# EAGLE design Pneumatic Pulse Controller mk3 (EAGLE 7.6.0)
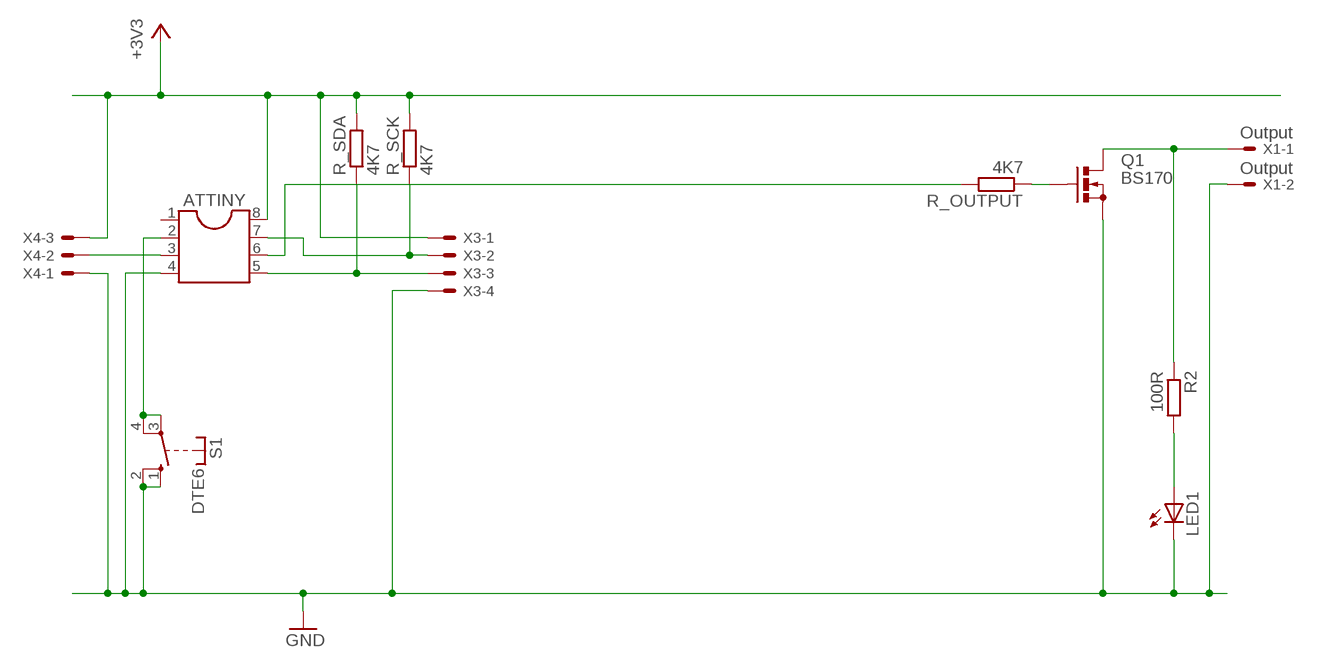
[diagram p0: schematic, sheet 1]

## Parts
ATTINY  DIL8  [DIL08]
LED1  LED3MM  [LED3MM]
Q1  BS170  [SOT54E]
R2  100R  R-EU_0204/7  [0204/7]
R_OUTPUT  4K7  R-EU_M0805  [M0805]
R_SCK  4K7  R-EU_M0805  [M0805]
R_SDA  4K7  R-EU_M0805  [M0805]
S1  DTE6  [DTE6]
X1  Output  KK-156-2  [KK-156-2]
X3  KK-156-4  [KK-156-4]
X4  KK-156-3  [KK-156-3]

## Nets
+3V3: ATTINY.8 R_SCK.2 R_SDA.2 X3.1 X4.3
GND: ATTINY.4 LED1.K(C) Q1.S S1.1(S) S1.2(S) X1.2 X3.4 X4.1
N$1: Q1.G R_OUTPUT.1
N$2: Q1.D R2.1 X1.1
N$5: ATTINY.3 X4.2
N$10: LED1.A R2.2
SCK: ATTINY.7 R_SCK.1 X3.2
SDA: ATTINY.5 R_SDA.1 X3.3
SWITCH: ATTINY.2 S1.3(P) S1.4(P)
VOUT: ATTINY.6 R_OUTPUT.2
Unconnected: ATTINY.1

## Library data of the parts
ATTINY = ic-package:DIL8: Dual In Line / Socket
LED1 = opto:LED: LED OSRAM: - CHIPLED LG R971, LG N971, LY N971, LG Q971, LY Q971, LO R971, LY R971 LH N974, LH R974 LS Q976, LO Q976, LY Q976 LO Q996 - Hyper CHIPLED LW Q18S LB Q993, LB Q99A, LB R99A - SideLED LS A670, LO A670, LY A670, LG A670, LP A670 LB A673, LV A673, LT A673, LW A673 LH A674 LY A675 LS A676, LA A676, LO A676, LY A676, LW A676 LS A679, LY A679, LG A679 - Hyper Micro SIDELED® LS Y876, LA Y876, LO Y876, LY Y876 LT Y87S - SmartLED LW L88C, LW L88S LB L89C, LB L89S, LG L890 LS L89K, LO L89K, LY L89K LS L896, LA L896, LO L896, LY L896 - TOPLED LS T670, LO T670, LY T670, LG T670, LP T670 LSG T670, LSP T670, LSY T670, LOP T670, LYG T670 LG T671, LOG T671, LSG T671 LB T673, LV T673, LT T673, LW T673 LH T674 LS T676, LA T676, LO T676, LY T676, LB T676, LH T676, LSB T676, LW T676 LB T67C, LV T67C, LT T67C, LS T67K, LO T67K, LY T67K, LW E67C LS E67B, LA E67B, LO E67B, LY E67B, LB E67C, LV E67C, LT E67C LW T67C LS T679, LY T679, LG T679 LS T770, LO T770, LY T770, LG T770, LP T770 LB T773, LV T773, LT T773, LW T773 LH T774 LS E675, LA E675, LY E675, LS T675 LS T776, LA T776, LO T776, LY T776, LB T776 LHGB T686 LT T68C, LB T68C - Hyper Mini TOPLED® LB M676 - Mini TOPLED Santana® LG M470 LS M47K, LO M47K, LY M47K Source: http://www.osram.convergy.de LUXEON: - LUMILED® LXK2-PW12-R00, LXK2-PW12-S00, LXK2-PW14-U00, LXK2-PW14-V00 LXK2-PM12-R00, LXK2-PM12-S00, LXK2-PM14-U00 LXK2-PE12-Q00, LXK2-PE12-R00, LXK2-PE12-S00, LXK2-PE14-T00, LXK2-PE14-U00 LXK2-PB12-K00, LXK2-PB12-L00, LXK2-PB12-M00, LXK2-PB14-N00, LXK2-PB14-P00, LXK2-PB14-Q00 LXK2-PR12-L00, LXK2-PR12-M00, LXK2-PR14-Q00, LXK2-PR14-R00 LXK2-PD12-Q00, LXK2-PD12-R00, LXK2-PD12-S00 LXK2-PH12-R00, LXK2-PH12-S00 LXK2-PL12-P00, LXK2-PL12-Q00, LXK2-PL12-R00 Source: www.luxeon.com KINGBRIGHT: KA-3528ASYC Source: www.kingbright.com
Q1 = opto:BS170: N-CHANNEL MOS FET
R2 = opto:R-EU_: RESISTOR, European symbol
R_OUTPUT R_SCK R_SDA = rcl:R-EU_: RESISTOR, European symbol
S1 = opto:DT: ITT SWITCH
X1 = con-molex:KK-156-2: KK 156 HEADER Source: http://www.molex.com/pdm_docs/sd/026604100_sd.pdf; OC_FARNELL: unknown; OC_NEWARK: unknown
X3 = con-molex:KK-156-4: KK 156 HEADER Source: http://www.molex.com/pdm_docs/sd/026604100_sd.pdf; OC_FARNELL: unknown; OC_NEWARK: unknown
X4 = con-molex:KK-156-3: KK 156 HEADER Source: http://www.molex.com/pdm_docs/sd/026604100_sd.pdf; OC_FARNELL: unknown; OC_NEWARK: unknown

## Board
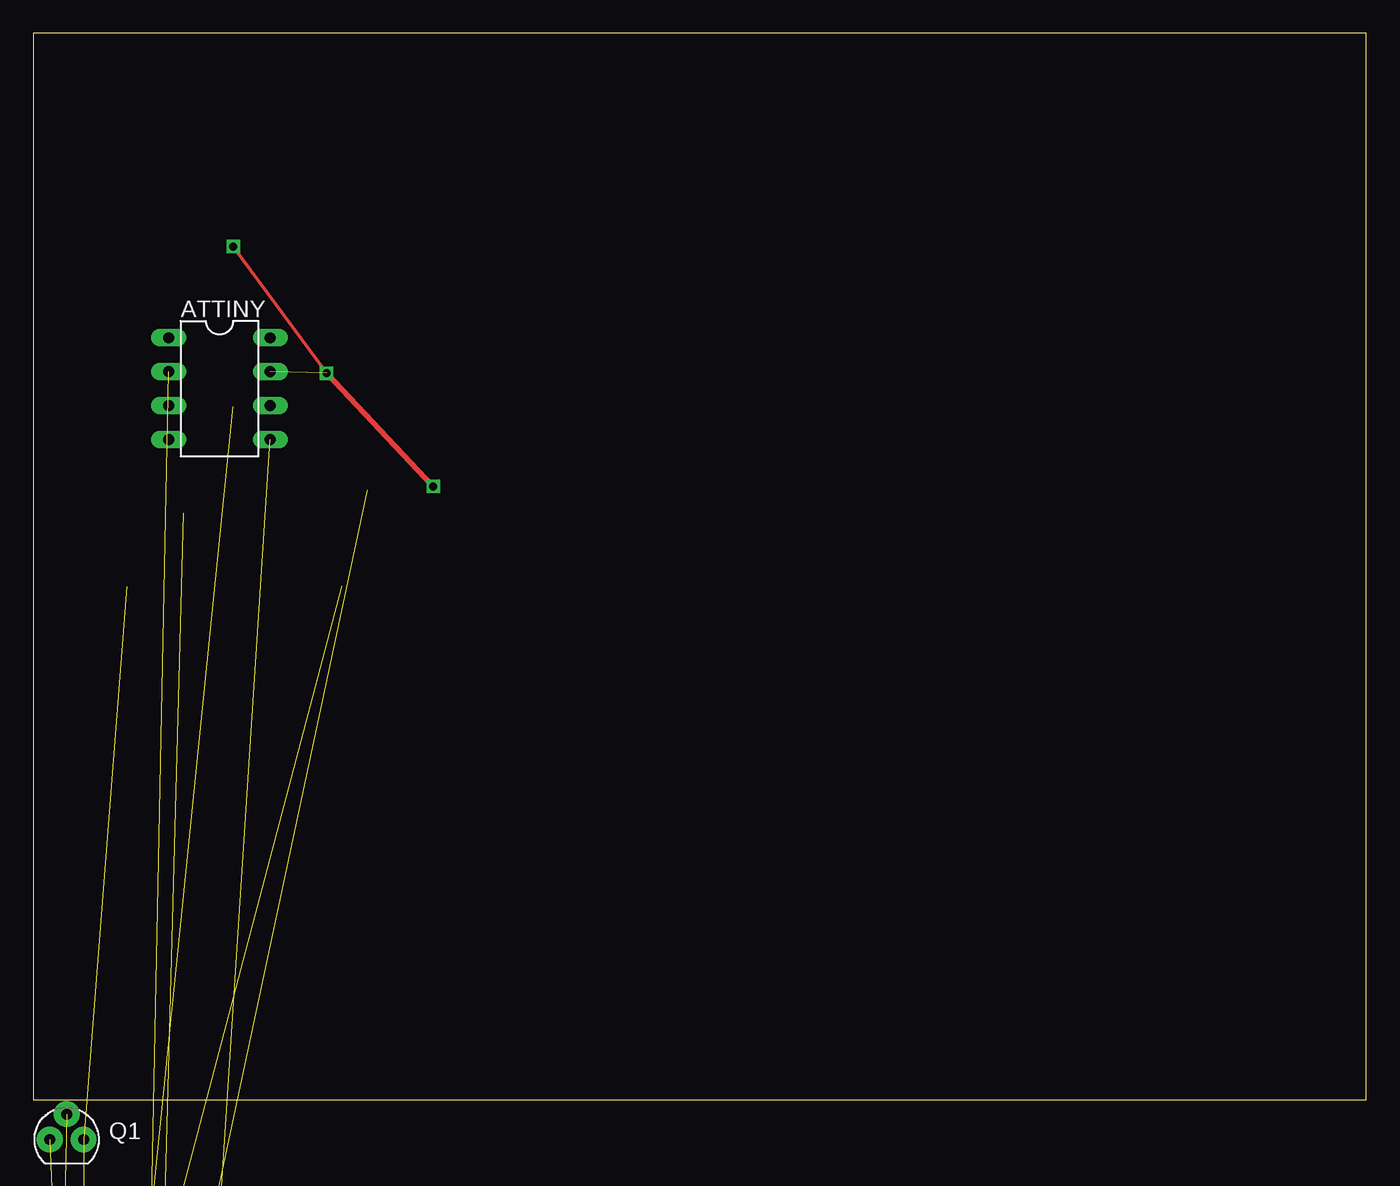
[diagram p1: board, top side]
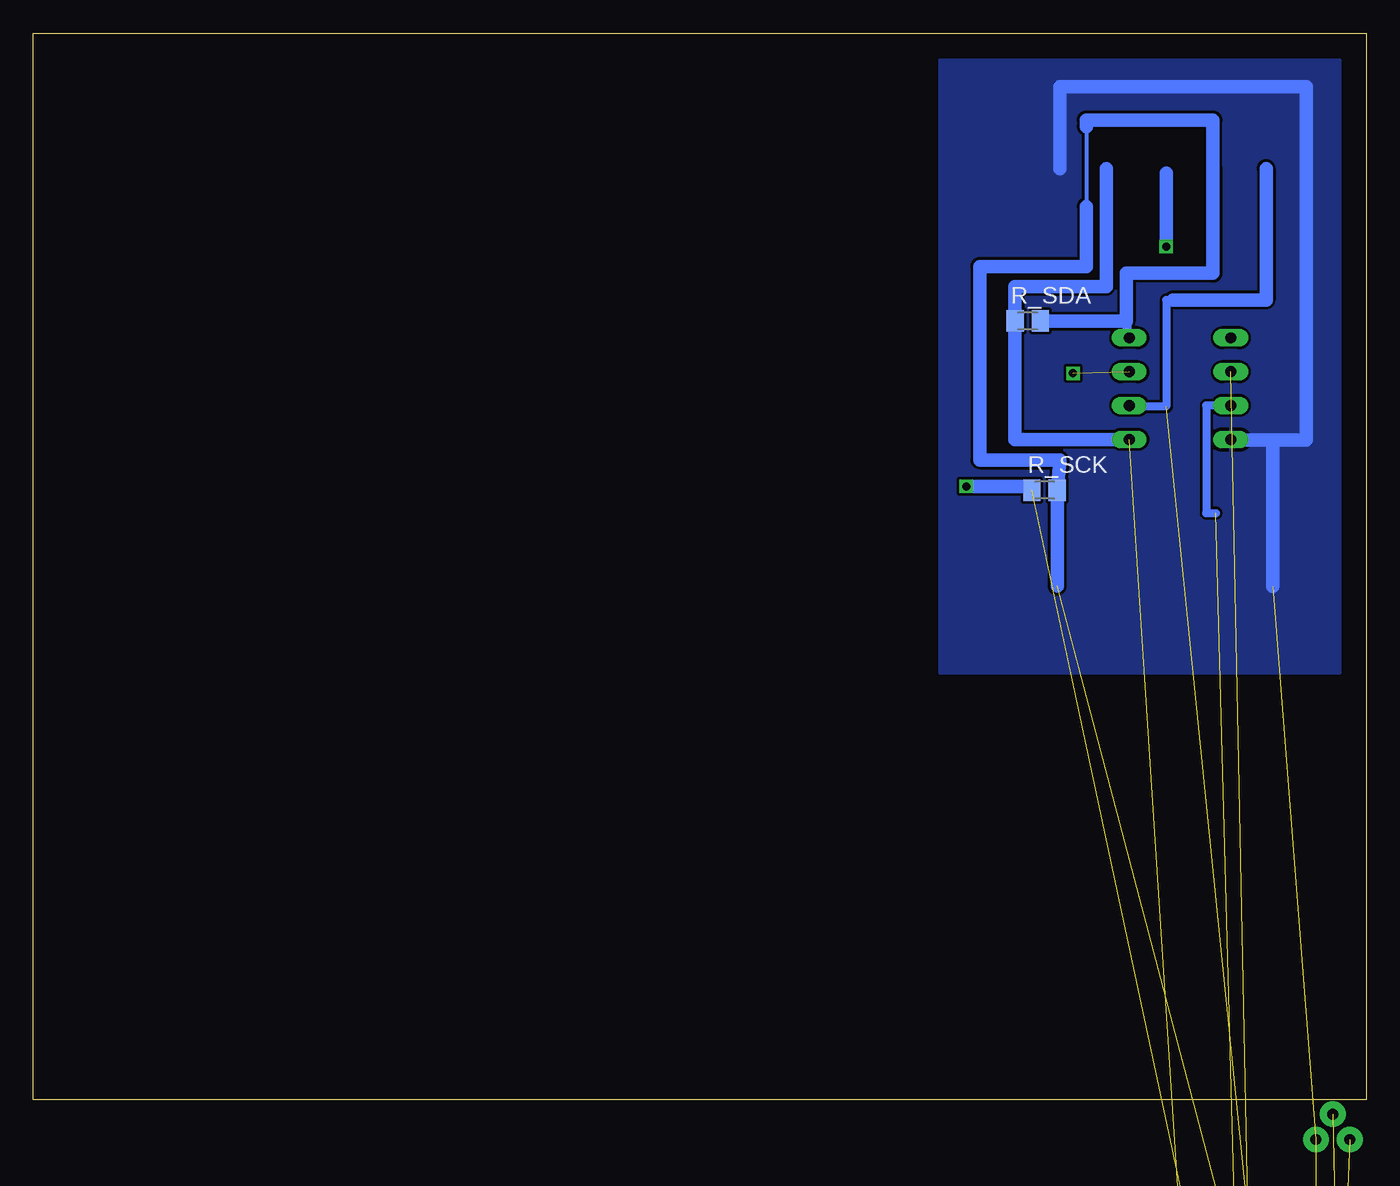
[diagram p2: board, bottom side, seen from below]

Size 100 x 80 mm. Coordinates in mm from the lower left corner, seen from the top.
Outline: 0,0 100,0 100,80 0,80 0,0
Copper layers (1*16): Top 0.035mm / dielectric 1.5mm / Bottom 0.035mm
Design rules "default": minimum track width 10mil, minimum drill 24mil, track to track 8mil, track to pad 8mil, pad to pad 8mil, via to via 8mil, smd to smd 8mil, copper to edge 40mil, drill to drill 8mil, minimum pad ring 10mil, minimum via ring 8mil, stop-mask expansion 4mil, vias tented up to drill 0mil, thermal gap 10mil

### Footprints (pad centres in the part's own frame; a part is rotated, then mirrored left to right if it is on the bottom)
DIL08 = drill 0.813 long: 1 -3.81,-3.81; 2 -1.27,-3.81; 3 1.27,-3.81; 4 3.81,-3.81; 5 3.81,3.81; 6 1.27,3.81; 7 -1.27,3.81; 8 -3.81,3.81
LED3MM = drill 0.813 pad 2.184 long: A -1.27,0; K 1.27,0
SOT54E = drill 0.813 pad 1.93: D -1.27,0; G 0,1.905; S 1.27,0
0204/7 = drill 0.813 pad 2.184 long: 1 -3.81,0; 2 3.81,0
M0805 = smd 1.3 x 1.6: 1 -0.95,0; 2 0.95,0
DTE6 = drill 1.118 pad 2.184 long: 1 -2.54,2.54; 2 2.54,2.54; 3 2.54,-2.54; 4 -2.54,-2.54
KK-156-2 = drill 1.7 pad 2.184 long: 1 -1.98,0; 2 1.98,0
KK-156-4 = drill 1.7 pad 2.184 long: 1 -5.94,0; 2 -1.98,0; 3 1.98,0; 4 5.94,0
KK-156-3 = drill 1.7 pad 2.184 long: 1 -3.96,0; 2 0,0; 3 3.96,0

### Placement (x,y rotation side)
ATTINY  13.97,53.34 270 top
LED1  2.5,-24.5 0 top  (outside the outline)
Q1  2.5,-3 0 top
R2  5.5,-14 0 top  (outside the outline)
R_OUTPUT  2,-67 0 top  (outside the outline)
R_SCK  24.13,45.72 0 bottom
R_SDA  25.4,58.42 0 bottom
S1  5.5,-45.5 0 top  (outside the outline)
X1  6.5,-75.5 0 top  (outside the outline)
X3  10.5,-32 0 top  (outside the outline)
X4  8.5,-59 0 top  (outside the outline)

### Tracks (layer width: path | path; a pad name or v marks a point on that pad's centre or on a via)
+3V3  (2 unrouted)
  Bottom 0.305: 21,73 21,67
  Bottom 0.406: ATTINY.8 18,62
  Bottom 0.61: 18,58.42 18,57.5 17.78,57.5 ATTINY.8
  Bottom 1.016: R_SDA.2 18,58.42 18,62 11.5,62 11.5,69.85 11.5,73.5 21,73.5 21,73 | 21,67 21,62.5 29,62.5 29,48 23,48 R_SCK.2 23.18,38.52
GND  (7 unrouted)
  Bottom 0.61: 10.16,49.5 ATTINY.4
  Bottom 1.016: 23,69.85 23,76 4.5,76 4.5,49.5 7,49.5 | 7,49.5 10.16,49.5 | 7,38.5 7,49.5
  pour Bottom: 2,78 32,78 32,32 2,32
N$1  (1 unrouted)
N$2  (2 unrouted)
N$5  (1 unrouted)
  Bottom 0.61: ATTINY.3 12,52.07 12,44 11.28,44
N$10  (1 unrouted)
SCK  (via drill 0.6)  (2 unrouted)
  Top 0.254: v15,64 v22,54.5
  Top 0.406: v30,46 v22,54.5
  Bottom 0.406: R_SCK.1 25.5,46
  Bottom 1.016: 25.5,46 v30,46 | 15,69.5 v15,64
SDA  (1 unrouted)
  Bottom 1.016: ATTINY.5 26.35,49.53 R_SDA.1 26.35,61 19.5,61 19.5,69.85
SWITCH  (2 unrouted)
VOUT  (1 unrouted)
  Bottom 0.406: 14.5,60 15,60
  Bottom 0.61: 15,60 15,52 17.78,52 ATTINY.6
  Bottom 1.016: 7.5,69.85 7.5,60 14.5,60